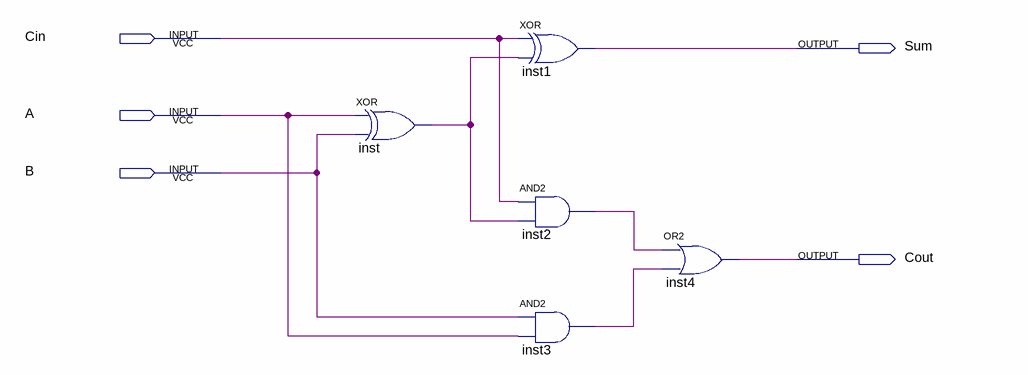
[diagram p0: schematic sheet]
// Quartus schematic Full_Adder.bdf as structural Verilog: 5 symbols, 5 pins
module Full_Adder (
  input  Cin,
  input  A,
  input  B,
  output Sum,
  output Cout
);

  wire inst2_out, inst3_out, inst_out;

  xor inst (inst_out, A, B);
  xor inst1 (Sum, Cin, inst_out);
  and inst2 (inst2_out, Cin, inst_out);
  and inst3 (inst3_out, B, A);
  or inst4 (Cout, inst2_out, inst3_out);
endmodule
